# Altium project TimeDrive.PrjPcb (part 1 of 2)
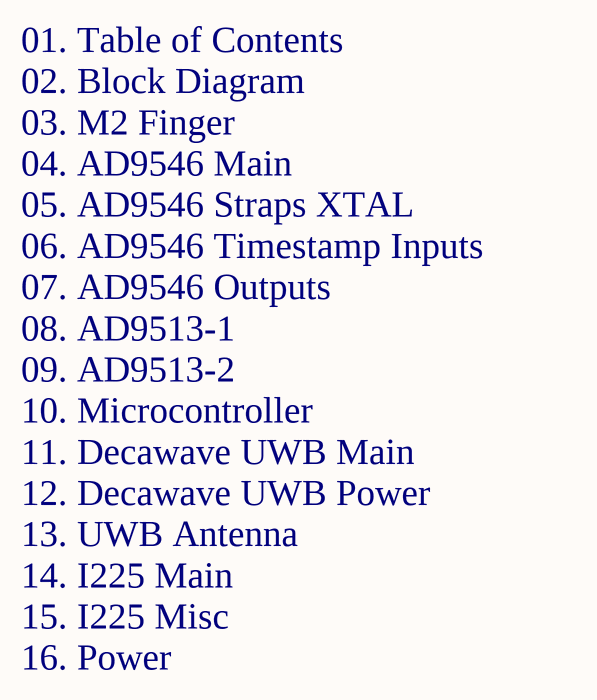
[diagram p0: 01-TableOfContents.SchDoc]
9 sheets, 225 parts. Net scope: global (net labels, ports and power ports of the same name join across sheets).
Board file: TimeDrive.PcbDoc
Sheets:
  01-TableOfContents.SchDoc
  03-M2Finger.SchDoc
  05-AD9546_StrapsXtal.SchDoc
  06-AD9546_TimestampInputs.SchDoc
  09-AD9513-2.SchDoc
  10-Microcontroller-1.SchDoc
  12-UWB-Power.SchDoc
  15-I225-MISC.SchDoc
  16-Power.SchDoc

## Sheet 01-TableOfContents.SchDoc
size A; SheetNumber: 1; SheetTotal: 1

### Notes on the sheet
- 01. Table of Contents
- 02. Block Diagram
- 03. M2 Finger
- 04. AD9546 Main
- 05. AD9546 Straps XTAL
- 06. AD9546 Timestamp Inputs
- 07. AD9546 Outputs
- 08. AD9513-1
- 09. AD9513-2
- 10. Microcontroller
- 11. Decawave UWB Main
- 12. Decawave UWB Power
- 13. UWB Antenna
- 14. I225 Main
- 15. I225 Misc
- 16. Power

## Sheet 03-M2Finger.SchDoc
size A; SheetNumber: 3; SheetTotal: 16
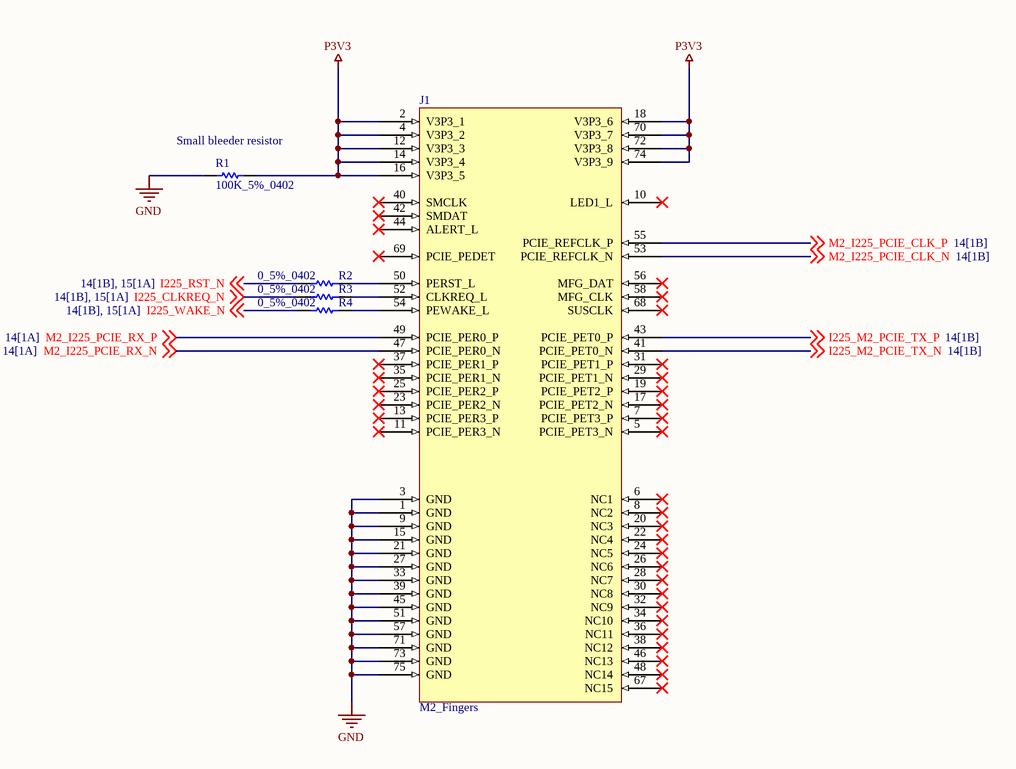
[diagram p1: 03-M2Finger.SchDoc]

### Parts
J1  M2_Fingers  [M.2 PCIe fingers]
R1  100K_5%_0402  [RESC1005X40X25LL05T05]
R2  0_5%_0402  [RESC1005X40X25LL10T10]
R3  0_5%_0402  [RESC1005X40X25LL10T10]
R4  0_5%_0402  [RESC1005X40X25LL10T10]

### Nets
GND: J1.1(GND) J1.3(GND) J1.9(GND) J1.15(GND) J1.21(GND) J1.27(GND) J1.33(GND) J1.39(GND) J1.45(GND) J1.51(GND) J1.57(GND) J1.71(GND) J1.73(GND) J1.75(GND) R1.1
P3V3: J1.2(V3P3_1) J1.4(V3P3_2) J1.12(V3P3_3) J1.14(V3P3_4) J1.16(V3P3_5) J1.18(V3P3_6) J1.70(V3P3_7) J1.72(V3P3_8) J1.74(V3P3_9) R1.2
I225_CLKREQ_N: R3.1 ; off-sheet I225_CLKREQ_N
I225_M2_PCIE_TX_N: J1.41(PCIE_PET0_N) ; off-sheet I225_M2_PCIE_TX_N
I225_M2_PCIE_TX_P: J1.43(PCIE_PET0_P) ; off-sheet I225_M2_PCIE_TX_P
I225_RST_N: R2.1 ; off-sheet I225_RST_N
I225_WAKE_N: R4.1 ; off-sheet I225_WAKE_N
M2_I225_PCIE_CLK_N: J1.53(PCIE_REFCLK_N) ; off-sheet M2_I225_PCIE_CLK_N
M2_I225_PCIE_CLK_P: J1.55(PCIE_REFCLK_P) ; off-sheet M2_I225_PCIE_CLK_P
M2_I225_PCIE_RX_N: J1.47(PCIE_PER0_N) ; off-sheet M2_I225_PCIE_RX_N
M2_I225_PCIE_RX_P: J1.49(PCIE_PER0_P) ; off-sheet M2_I225_PCIE_RX_P
NetJ1_50: J1.50(PERST_L) R2.2
NetJ1_52: J1.52(CLKREQ_L) R3.2
NetJ1_54: J1.54(PEWAKE_L) R4.2

Not connected (* = marked no-connect by the designer): J1 5(PCIE_PET3_N)* 6(NC1)* 7(PCIE_PET3_P)* 8(NC2)* 10(LED1_L)* 11(PCIE_PER3_N)* 13(PCIE_PER3_P)* 17(PCIE_PET2_N)* 19(PCIE_PET2_P)* 20(NC3)* 22(NC4)* 23(PCIE_PER2_N)* 24(NC5)* 25(PCIE_PER2_P)* 26(NC6)* 28(NC7)* 29(PCIE_PET1_N)* 30(NC8)* 31(PCIE_PET1_P)* 32(NC9)* 34(NC10)* 35(PCIE_PER1_N)* 36(NC11)* 37(PCIE_PER1_P)* 38(NC12)* 40(SMCLK)* 42(SMDAT)* 44(ALERT_L)* 46(NC13)* 48(NC14)* 56(MFG_DAT)* 58(MFG_CLK)* 67(NC15)* 68(SUSCLK)* 69(PCIE_PEDET)*

### Notes on the sheet
- (near R1) Small bleeder resistor

### Library data of the parts
R1 = CMP-2002-08125-1: Part Number: CRCW0402100KJNED; Manufacturer: Vishay Dale
R2-R4 = CMP-2002-04569-1: Manufacturer: KOA Speer; Part Number: RK73Z1ETTP

## Sheet 05-AD9546_StrapsXtal.SchDoc
size A; SheetNumber: 5; SheetTotal: 16
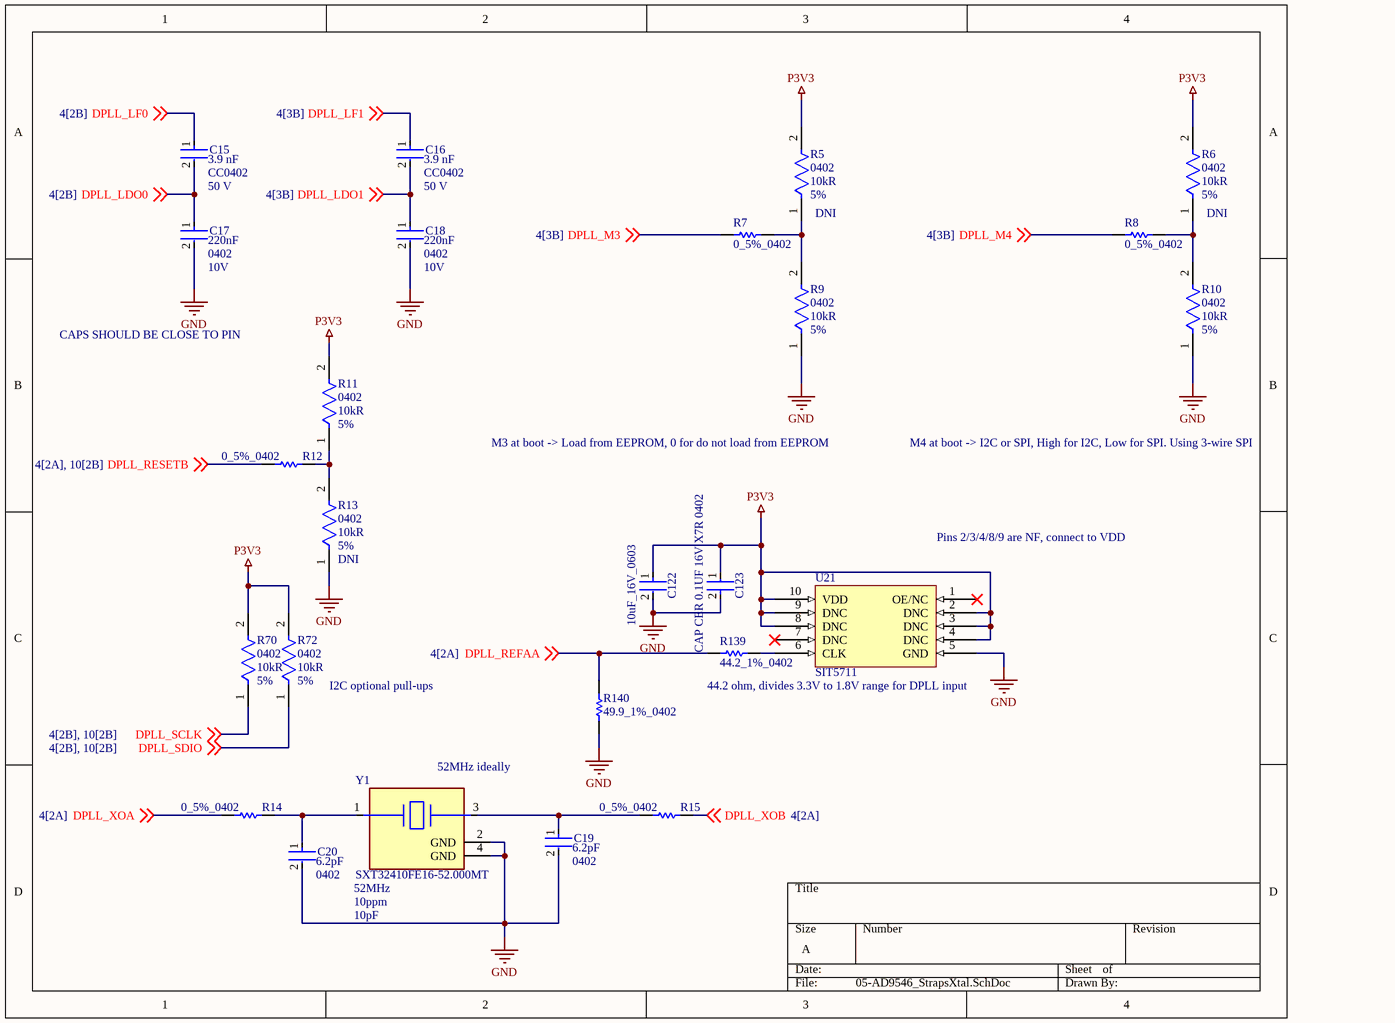
[diagram p2: 05-AD9546_StrapsXtal.SchDoc]

### Parts
C15  value 3.9 nF  Voltage Rating: 50 V  Package: CC0402  [FP-CC0402-MFG]  (hidden comment: CC0402KRX7R9BB392)
C16  value 3.9 nF  Voltage Rating: 50 V  Package: CC0402  [FP-CC0402-MFG]  (hidden comment: CC0402KRX7R9BB392)
C17  Voltage: 10V  Case/Package: 0402  Capacitance: 220nF  [FP-GRM155-0_05-IPC_A]  (hidden comment: GRM155R61A224KE19D)
C18  Voltage: 10V  Case/Package: 0402  Capacitance: 220nF  [FP-GRM155-0_05-IPC_A]  (hidden comment: GRM155R61A224KE19D)
C19  Case/Package: 0402  Capacitance: 6.2pF  [FP-CL468-IPC_C]  (hidden comment: CL05C6R2CB5NNNC)
C20  Case/Package: 0402  Capacitance: 6.2pF  [FP-CL468-IPC_C]  (hidden comment: CL05C6R2CB5NNNC)
C122  10uF_16V_0603  [FP-C1608-MFG]
C123  GRM155R71C104KA88D  [FP-GRM15-MFG]  (value not drawn)
R5  Case/Package: 0402  Resistance: 10kR  Tolerance: 5%  [FP-CRCW0402-e3-IPC_B]  (hidden comment: CRCW040210K0JNED)  (no BOM)
R6  Case/Package: 0402  Resistance: 10kR  Tolerance: 5%  [FP-CRCW0402-e3-IPC_B]  (hidden comment: CRCW040210K0JNED)  (no BOM)
R7  0_5%_0402  [RESC1005X40X25ML05T10]
R8  0_5%_0402  [RESC1005X40X25ML05T10]
R9  Case/Package: 0402  Resistance: 10kR  Tolerance: 5%  [FP-CRCW0402-e3-IPC_B]  (hidden comment: CRCW040210K0JNED)
R10  Case/Package: 0402  Resistance: 10kR  Tolerance: 5%  [FP-CRCW0402-e3-IPC_B]  (hidden comment: CRCW040210K0JNED)
R11  Case/Package: 0402  Resistance: 10kR  Tolerance: 5%  [FP-CRCW0402-e3-IPC_B]  (hidden comment: CRCW040210K0JNED)
R12  0_5%_0402  [RESC1005X40X25LL10T10]
R13  Case/Package: 0402  Resistance: 10kR  Tolerance: 5%  [FP-CRCW0402-e3-IPC_B]  (hidden comment: CRCW040210K0JNED)  (no BOM)
R14  0_5%_0402  [RESC1005X40X25LL10T10]
R15  0_5%_0402  [RESC1005X40X25LL10T10]
R70  Case/Package: 0402  Resistance: 10kR  Tolerance: 5%  [FP-CRCW0402-e3-IPC_B]  (hidden comment: CRCW040210K0JNED)
R72  Case/Package: 0402  Resistance: 10kR  Tolerance: 5%  [FP-CRCW0402-e3-IPC_B]  (hidden comment: CRCW040210K0JNED)
R139  44.2_1%_0402  [RESC0402(1005)_M]
R140  49.9_1%_0402  [RESC1005X40X25NL05T05]
U21  SIT5711  [SIT5711]
Y1  SXT32410FE16-52.000MT  Frequency: 52MHz  Frequency Stability: 10ppm  Load Capacitance: 10pF  [FP-402-MFG]

### Nets
GND: C17.2 C18.2 C19.2 C20.2 C122.2 C123.2 R9.1 R10.1 R13.1 R140.1 U21.5(GND) Y1.2(GND) Y1.4(GND)
P3V3: C122.1 C123.1 R5.2 R6.2 R11.2 R70.2 R72.2 U21.2(DNC) U21.3(DNC) U21.4(DNC) U21.8(DNC) U21.9(DNC) U21.10(VDD)
DPLL_LDO0: C15.2 C17.1 ; off-sheet DPLL_LDO0
DPLL_LDO1: C16.2 C18.1 ; off-sheet DPLL_LDO1
DPLL_LF0: C15.1 ; off-sheet DPLL_LF0
DPLL_LF1: C16.1 ; off-sheet DPLL_LF1
DPLL_M3: R7.1 ; off-sheet DPLL_M3
DPLL_M4: R8.1 ; off-sheet DPLL_M4
DPLL_REFAA: R139.1 R140.2 ; off-sheet DPLL_REFAA
DPLL_RESETB: R12.1 ; off-sheet DPLL_RESETB
DPLL_SCLK: R70.1 ; off-sheet DPLL_SCLK
DPLL_SDIO: R72.1 ; off-sheet DPLL_SDIO
DPLL_XOA: R14.1 ; off-sheet DPLL_XOA
DPLL_XOB: R15.2 ; off-sheet DPLL_XOB
NetC19_1: C19.1 R15.1 Y1.3
NetC20_1: C20.1 R14.2 Y1.1
NetR5_1: R5.1 R7.2 R9.2
NetR6_1: R6.1 R8.2 R10.2
NetR11_1: R11.1 R12.2 R13.2
NetR139_2: R139.2 U21.6(CLK)

Not connected (* = marked no-connect by the designer): U21 1(OE/NC)* 7(DNC)*

### Notes on the sheet
- CAPS SHOULD BE CLOSE TO PIN
- M3 at boot -> Load from EEPROM, 0 for do not load from EEPROM
- M4 at boot -> I2C or SPI, High for I2C, Low for SPI. Using 3-wire SPI
- Pins 2/3/4/8/9 are NF, connect to VDD
- (near R72) I2C optional pull-ups
- 44.2 ohm, divides 3.3V to 1.8V range for DPLL input
- (near Y1) 52MHz ideally

### Library data of the parts
C15 C16 = CMP-03422-000890-1: CAP CER 3900PF 50V X7R 0402; Manufacturer: YAGEO; Tolerance: 0.1; Temperature Coefficient: 30ppm/°C; Material: Ceramic; Automotive Grade: NA; Digikey Description: CAP CER 3900PF 50V X7R 0402; Octopart: https://octopart.com/cc0402krx7r9bb392-yageo-9291741; Category: Cap; Temperature Characteristic: X7R; Footprint Url: http://www.yageo.com/exep/pages/download/literatures/UPY-C_GEN_24.pdf; Height: 0.55mm; ComponentLink2Description: Datasheet; Capacitance: 3.9 nF; RoHS: TRUE; Device Class L1: Passive Components; ComponentLink2URL: http://www.yageo.com/documents/recent/UPY-GP_NP0_16V-to-50V_16.pdf; Temperature Range Low: -55°C; Automotive: No; Manufacturer Part Number: CC0402KRX7R9BB392; Temperature: -55°C to +125°C; Ipc Land Pattern Name: CAPC10050X50; Device Class L3: Ceramic Capacitors; Device Class L2: Capacitors; Mouser Description: Multilayer Ceramic Capacitors MLCC - SMD/SMT 3.9nF 50V X7R 10%; Lead Free: Yes; Temperature Range High: +125°C
C17 C18 = CMP-2008-04561-5: CAP CER 0.22UF 10V X5R 0402; Tolerance: 10%; Material: Ceramic; Insulation Resistance: 10GR; Package Quantity: 1; Termination: SMD/SMT; Max Operating Temperature: 85°C; REACH SVHC: No SVHC; Thickness: 0.022inch; Mount: Surface Mount; Height: 0.5mm; Length: 1mm; Lead Free: Lead Free; Number of Pins: 2; Case Code (Imperial): 0402; Min Operating Temperature: -55°C; Packaging: Tape and Reel; Dielectric: X5R; Depth: 0.5mm; Series: GRM; Case Code (Metric): 1005; Radiation Hardening: No; RoHS Compliant: Yes; Voltage Rating (DC): 10V; Voltage Rating: 10V; Dielectric Material: Ceramic; Width: 0.5mm
C19 C20 = CMP-13271-000420-1: Cap Ceramic 6.2pF 50V C0G ±0.25pF SMD 0402 +125°C Paper T/R; Radiation Hardening: No; Voltage Rating (DC): 50V; Thickness: 0.022inch; Height: 0.5mm; Case Code (Metric): 1005; Max Operating Temperature: 125°C; Case Code (Imperial): 0402; Voltage Rating: 50V; Min Operating Temperature: -55°C; Width: 0.02inch; Depth: 0.5mm; Length: 1mm; Dielectric: C0G; Packaging: Tape and Reel; Mount: Surface Mount
C122 = CMP-08246-000019-1: CAP CER 10UF 16V X5R 0603; Manufacturer: TDK Corporation; Manufacturer Part Number: C1608X5R1C106M080AB; Temperature Coefficient: 15%; Tolerance: 20%; Material: Ceramic; Octopart: https://octopart.com/c1608x5r1c106m080ab-tdk-26013480; ComponentLink2Description: Datasheet; Value: 10uF; Temperature Range Low: -55°C; Digikey Description: CAP CER 10UF 16V X5R 0603; Package: C1608; Lead Free: Yes; Mouser Description: Multilayer Ceramic Capacitors MLCC - SMD/SMT 0603 10uF 16volts X5R +/-20% GP; Device Class L2: Capacitors; Voltage Rating: 16V; RoHS: TRUE; Automotive: No; Height: 0.9mm; Ipc Land Pattern Name: CAPC16080X80; ComponentLink2URL: https://upverter.com/datasheet/6fbac97fd59b4a24a005814037d2a36a27db40e9.pdf; Temperature Range High: +85°C; Capacitance: 10uF; Temperature: -55°C to +85°C; Category: Cap; Device Class L1: Passive Components; Device Class L3: Ceramic Capacitors; Temperature Characteristic: X5R
C123 = CMP-2100-03641-2: CAP CER 0.1UF 16V X7R 0402; Manufacturer: Murata; Standoff Height: 0mm; Tolerance: 10%; Voltage Rating: 16Vdc; Material: Ceramic; Capacitance: 0.10μF; Value: 0.10μF; RoHS: TRUE; Manufacturer Part Number: GRM155R71C104KA88D; Temperature Characteristic: X7R; Octopart: https://octopart.com/grm155r71c104ka88d-murata-196880; Digikey Description: CAP CER 0.1UF 16V X7R 0402; Device Class L3: Ceramic Capacitors; Height: 0.55mm; ComponentLink2Description: Datasheet; Temperature Range Low: -55°C; Ipc Land Pattern Name: CAPC10050X219; ComponentLink2URL: https://search.murata.co.jp/Ceramy/image/img/A01X/G101/ENG/GRM155R71H471KA01-01A.pdf; Device Class L1: Passive Components; Lead Free: yes; Category: Cap; Package: GRM15; Temperature: -55°C to +125°C; Device Class L2: Capacitors; Temperature Range High: +125°C; Mouser Description: 0402 0.1 uF 16V ±10 % Tolerance X7R SMT Multilayer Ceramic Capacitor
R5 R6 R9-R11 R13 R70 R72 = CMP-2002-08136-3: RES Thick Film, 10kΩ, 5%, 0.063W, 200ppm/°C, 0402; Voltage Rating: 50V; Power Rating: 63mW; Military Standard: Not; Packaging: Tape and Reel; Case Code (Imperial): 0402; Min Operating Temperature: -55°C; Case Code (Metric): 1005; Temperature Coefficient: 200ppm/°C; Termination: SMD/SMT; Composition: Thick Film; Depth: 0.5mm; Number of Terminations: 2; Contact Plating: Tin; Height: 0.016inch; Width: 0.5mm; Max Operating Temperature: 155°C; Features: Automotive AEC-Q200; Length: 1mm; Radiation Hardening: No; Max Power Dissipation: 63mW; Mount: Surface Mount; Package Quantity: 1; Weight: 2.3E-05oz
  R5 R6 R13: DNI: DNI
R7 R8 = CMP-2002-03041-1: Part Number: CRCW04020000Z0EDHP; Manufacturer: Vishay Dale
R12 R14 R15 = CMP-2002-04569-1: as R2 on sheet 03-M2Finger
R139 = CMP-1011-00357-1: 44R2 0.063W 1% 0402 (1005 Metric)  SMD; Case-Metric: 1005; Value: 44.20 Ohm; Case-EIA: 0402; Tolerance: 1 %; Technology: SMT; Power: 0.063 W
R140 = CMP-2002-00969-1: Manufacturer: Panasonic; Part Number: ERJ-2RKF49R9X
Y1 = CMP-06858-000005-1: CRYSTAL 32.0000MHZ 10PF SMD; Series Resistance: 100R; Width: 0.063inch; Height: 0.022inch; Frequency Tolerance: 10ppm; Length: 0.079inch; Contact Plating: Gold; Package Quantity: 3000; Case/Package: SMD/SMT; ESR (Equivalent Series Resistance): 100R; Min Operating Temperature: -20°C; Tolerance: 10ppm; Packaging: Tape and Reel; Max Operating Temperature: 70°C; Mount: Surface Mount; Termination: SMD/SMT

## Sheet 06-AD9546_TimestampInputs.SchDoc
size A; SheetNumber: 6; SheetTotal: 16
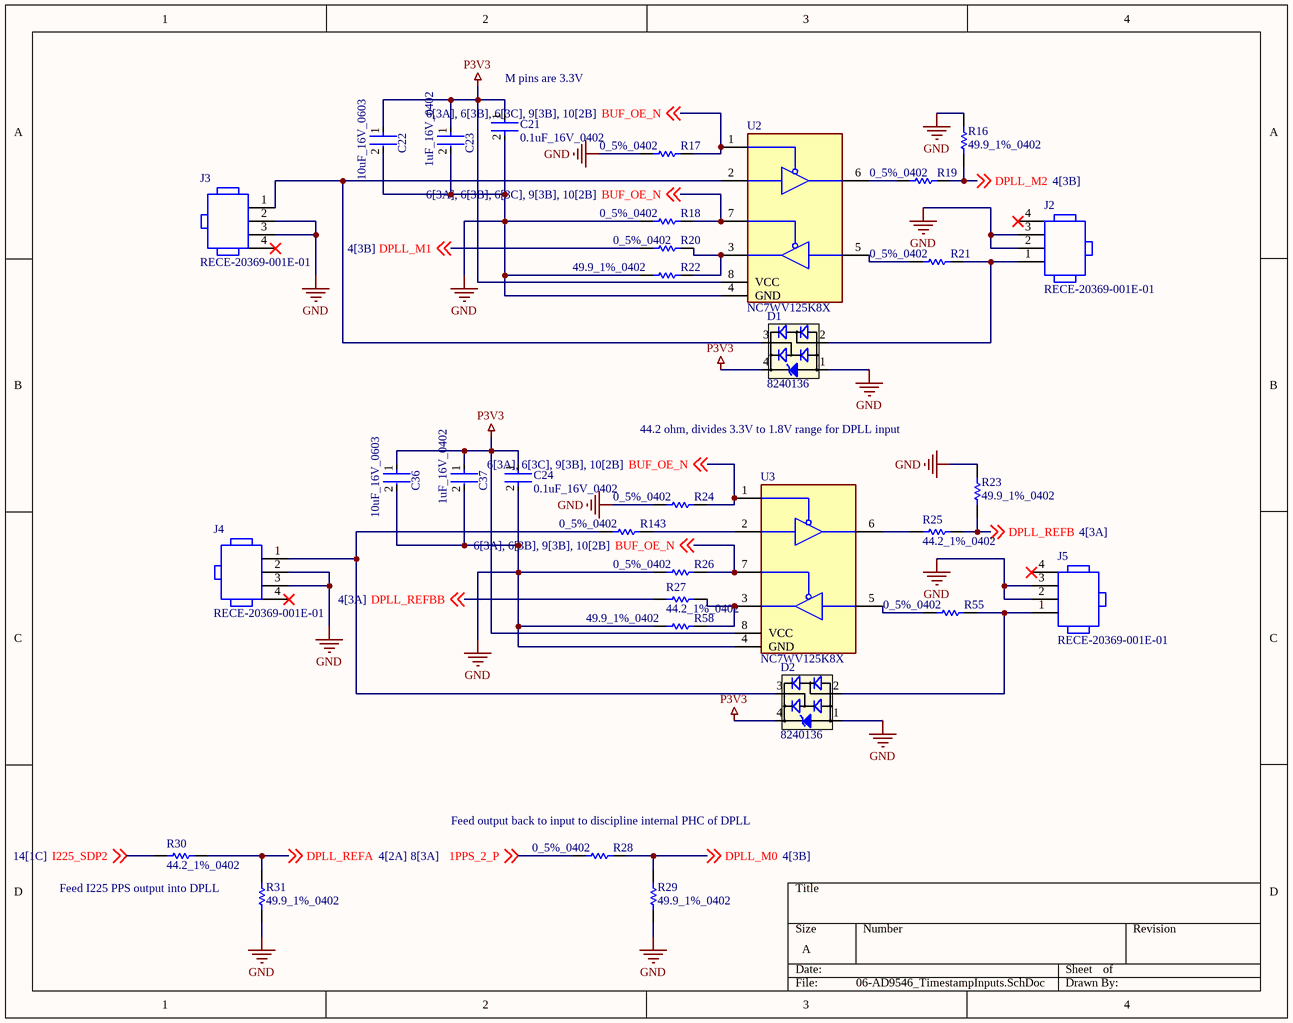
[diagram p3: 06-AD9546_TimestampInputs.SchDoc]

### Parts
C21  Digikey Description: 0.1uF_16V_0402  [FP-GRM15-MFG]  (hidden comment: GRM155R71C104KA88D)
C22  10uF_16V_0603  [FP-C1608-MFG]
C23  1uF_16V_0402  [FP-0402-L_1_0_0_05-W_0_5-IPC_C]
C24  Digikey Description: 0.1uF_16V_0402  [FP-GRM15-MFG]  (hidden comment: GRM155R71C104KA88D)
C36  10uF_16V_0603  [FP-C1608-MFG]
C37  1uF_16V_0402  [FP-0402-L_1_0_0_05-W_0_5-IPC_C]
D1  8240136  [SOT143-4L]
D2  8240136  [SOT143-4L]
J2  RECE-20369-001E-01  [TG-RECE-20369-001E-4_V]
J3  RECE-20369-001E-01  [TG-RECE-20369-001E-4_V]
J4  RECE-20369-001E-01  [TG-RECE-20369-001E-4_V]
J5  RECE-20369-001E-01  [TG-RECE-20369-001E-4_V]
R16  49.9_1%_0402  [RESC1005X40X25NL05T05]
R17  0_5%_0402  [RESC1005X40X25LL10T10]  (no BOM)
R18  0_5%_0402  [RESC1005X40X25LL10T10]
R19  0_5%_0402  [RESC1005X40X25LL10T10]
R20  0_5%_0402  [RESC1005X40X25LL10T10]
R21  0_5%_0402  [RESC1005X40X25LL10T10]
R22  49.9_1%_0402  [RESC1005X40X25NL05T05]
R23  49.9_1%_0402  [RESC1005X40X25NL05T05]
R24  0_5%_0402  [RESC1005X40X25LL10T10]
R25  44.2_1%_0402  [RESC1005X40X25LL05T05]
R26  0_5%_0402  [RESC1005X40X25LL10T10]
R27  44.2_1%_0402  [RESC1005X40X25LL05T05]
R28  0_5%_0402  [RESC1005X40X25LL10T10]
R29  49.9_1%_0402  [RESC1005X40X25NL05T05]
R30  44.2_1%_0402  [RESC1005X40X25LL05T05]
R31  49.9_1%_0402  [RESC1005X40X25NL05T05]
R55  0_5%_0402  [RESC1005X40X25LL10T10]
R58  49.9_1%_0402  [RESC1005X40X25NL05T05]
R143  0_5%_0402  [RESC1005X40X25LL10T10]
U2  NC7WV125K8X  [NC7WV125]
U3  NC7WV125K8X  [NC7WV125]

### Nets
GND: C21.2 C22.2 C23.2 C24.2 C36.2 C37.2 D1.1(GND) D2.1(GND) J2.2 J2.3 J3.2 J3.3 J4.2 J4.3 J5.2 J5.3 R16.2 R17.1 R18.1 R22.2 R23.2 R24.1 R26.1 R29.1 R31.1 R58.2 U2.4(GND) U3.4(GND)
P3V3: C21.1 C22.1 C23.1 C24.1 C36.1 C37.1 D1.4(VDD) D2.4(VDD) U2.8(VCC) U3.8(VCC)
1PPS_2_P: R28.1 ; off-sheet 1PPS_2_P
BUF_OE_N: R17.2 R18.2 R24.2 R26.2 U2.1 U2.7 U3.1 U3.7 ; off-sheet BUF_OE_N
DPLL_M0: R28.2 R29.2 ; off-sheet DPLL_M0
DPLL_M1: R20.1 ; off-sheet DPLL_M1
DPLL_M2: R16.1 R19.2 ; off-sheet DPLL_M2
DPLL_REFA: R30.2 R31.2 ; off-sheet DPLL_REFA
DPLL_REFB: R23.1 R25.2 ; off-sheet DPLL_REFB
DPLL_REFBB: R27.1 ; off-sheet DPLL_REFBB
I225_SDP2: R30.1 ; off-sheet I225_SDP2
NetD1_2: D1.2(I/O1) J2.1 R21.2
NetD1_3: D1.3(I/O2) J3.1 U2.2
NetD2_2: D2.2(I/O1) J5.1 R55.2
NetD2_3: D2.3(I/O2) J4.1 R143.1
NetR19_1: R19.1 U2.6
NetR20_2: R20.2 R22.1 U2.3
NetR21_1: R21.1 U2.5
NetR25_1: R25.1 U3.6
NetR27_2: R27.2 R58.1 U3.3
NetR55_1: R55.1 U3.5
NetR143_2: R143.2 U3.2

Not connected (* = marked no-connect by the designer): J2 4*; J3 4*; J4 4*; J5 4*

### Notes on the sheet
- (near C21) M pins are 3.3V
- 44.2 ohm, divides 3.3V to 1.8V range for DPLL input
- (near R28) Feed output back to input to discipline internal PHC of DPLL
- Feed I225 PPS output into DPLL

### Library data of the parts
C21 C24 = CMP-2100-03641-2: as C123 on sheet 05-AD9546_StrapsXtal; RoHS: TRUE; Manufacturer Part Number: GRM155R71C104KA88D; Temperature Characteristic: X7R; Octopart: https://octopart.com/grm155r71c104ka88d-murata-196880; Device Class L3: Ceramic Capacitors; Height: 0.55mm; ComponentLink2Description: Datasheet; Temperature Range Low: -55°C; Ipc Land Pattern Name: CAPC10050X219; ComponentLink2URL: https://search.murata.co.jp/Ceramy/image/img/A01X/G101/ENG/GRM155R71H471KA01-01A.pdf; Device Class L1: Passive Components; Lead Free: yes; Category: Cap; Package: GRM15; Temperature: -55°C to +125°C; Device Class L2: Capacitors; Temperature Range High: +125°C; Mouser Description: 0402 0.1 uF 16V ±10 % Tolerance X7R SMT Multilayer Ceramic Capacitor
C22 C36 = CMP-08246-000019-1: as C122 on sheet 05-AD9546_StrapsXtal; Octopart: https://octopart.com/c1608x5r1c106m080ab-tdk-26013480; ComponentLink2Description: Datasheet; Value: 10uF; Temperature Range Low: -55°C; Digikey Description: CAP CER 10UF 16V X5R 0603; Package: C1608; Lead Free: Yes; Mouser Description: Multilayer Ceramic Capacitors MLCC - SMD/SMT 0603 10uF 16volts X5R +/-20% GP; Device Class L2: Capacitors; Voltage Rating: 16V; RoHS: TRUE; Automotive: No; Height: 0.9mm; Ipc Land Pattern Name: CAPC16080X80; ComponentLink2URL: https://upverter.com/datasheet/6fbac97fd59b4a24a005814037d2a36a27db40e9.pdf; Temperature Range High: +85°C; Capacitance: 10uF; Temperature: -55°C to +85°C; Category: Cap; Device Class L1: Passive Components; Device Class L3: Ceramic Capacitors; Temperature Characteristic: X5R
C23 C37 = CMP-14477-003537-2: None; Tolerance: 20%; Voltage Rating (DC): 16V; Capacitance: 1uF; Dielectric: X5R; Height: 0.5mm; Package Quantity: 10000; Series: M; Max Operating Temperature: 85°C; Width: 0.02inch; Mount: Surface Mount; Thickness: 0.022inch; Length: 1mm; Min Operating Temperature: -55°C; Depth: 0.5mm; RoHS Compliant: Yes; Construction: Flat; Case/Package: 0402; Radiation Hardening: No; Packaging: Tape and Reel; Voltage: 16V; Voltage Rating: 16V; Halogen Free: Halogen Free
D1 D2 = CMP-1486-00002-1: TVS Diode WE-TVS-HS, VRWM=3.3V; Manufacturer: Wuerth Elektronik; Reverse Stand Off Voltage: 3.3V; PartNumber: 8240136; ComponentLink1Description: Manufacturer URL; PackageReference: SOT143-4L; ComponentLink1URL: http://www.we-online.com; ComponentLink2Description: Datasheet; ComponentLink2URL: http://katalog.we-online.de/kataloge/eisos/media/pdf/8240136.pdf
J2-J5 = CMP-0275-00001-2: RF Connector, Onboard Receptacle, IPEX MHFIII; Manufacturer: Taoglas; Packing: Tape and Reel; Mounting Technology: Surface Mount; PackageReference: RECE-20369-001E-01-4; ComponentLink1URL: http://www.taoglas.com/; Housing Color: Gold; DatasheetVersion: Rev. C; ComponentLink2URL: http://www.taoglas.com/images/product_images/original_images/RECE.20369.001E.01.pdf; ComponentLink3Description: Package Specification; PackageVersion: Rev. C; ComponentLink1Description: Manufacturer URL; ComponentLink2Description: Datasheet; PackageDescription: 4-Pin, Hand Drawn, Body 1.7x1.7mm; ComponentLink3URL: http://www.taoglas.com/images/product_images/original_images/RECE.20369.001E.01.pdf; PartNumber: RECE-20369-001E-01
R16 R22 R23 R29 R31 R58 = CMP-2002-00969-1: as R140 on sheet 05-AD9546_StrapsXtal
R17-R21 R24 R26 R28 R55 R143 = CMP-2002-04569-1: as R2 on sheet 03-M2Finger
R25 R27 R30 = CMP-2002-00011-1: Manufacturer: Vishay Dale; Part Number: CRCW040244R2FKED
U2 U3 = NC7WV125K8X: Integrated Circuit; Manufacturer_Name: ON Semiconductor; Datasheet Link: https://www.mouser.com/datasheet/2/308/NC7WV125-1301459.pdf; Height: 0.9mm; Manufacturer_Part_Number: NC7WV125K8X; Mouser Part Number: 512-NC7WV125K8X; Mouser Price/Stock: https://www.mouser.com/Search/Refine.aspx?Keyword=512-NC7WV125K8X; Arrow Part Number: NC7WV125K8X; Arrow Price/Stock: https://www.arrow.com/en/products/nc7wv125k8x/on-semiconductor

## Sheet 09-AD9513-2.SchDoc
size A; SheetNumber: 9; SheetTotal: 16
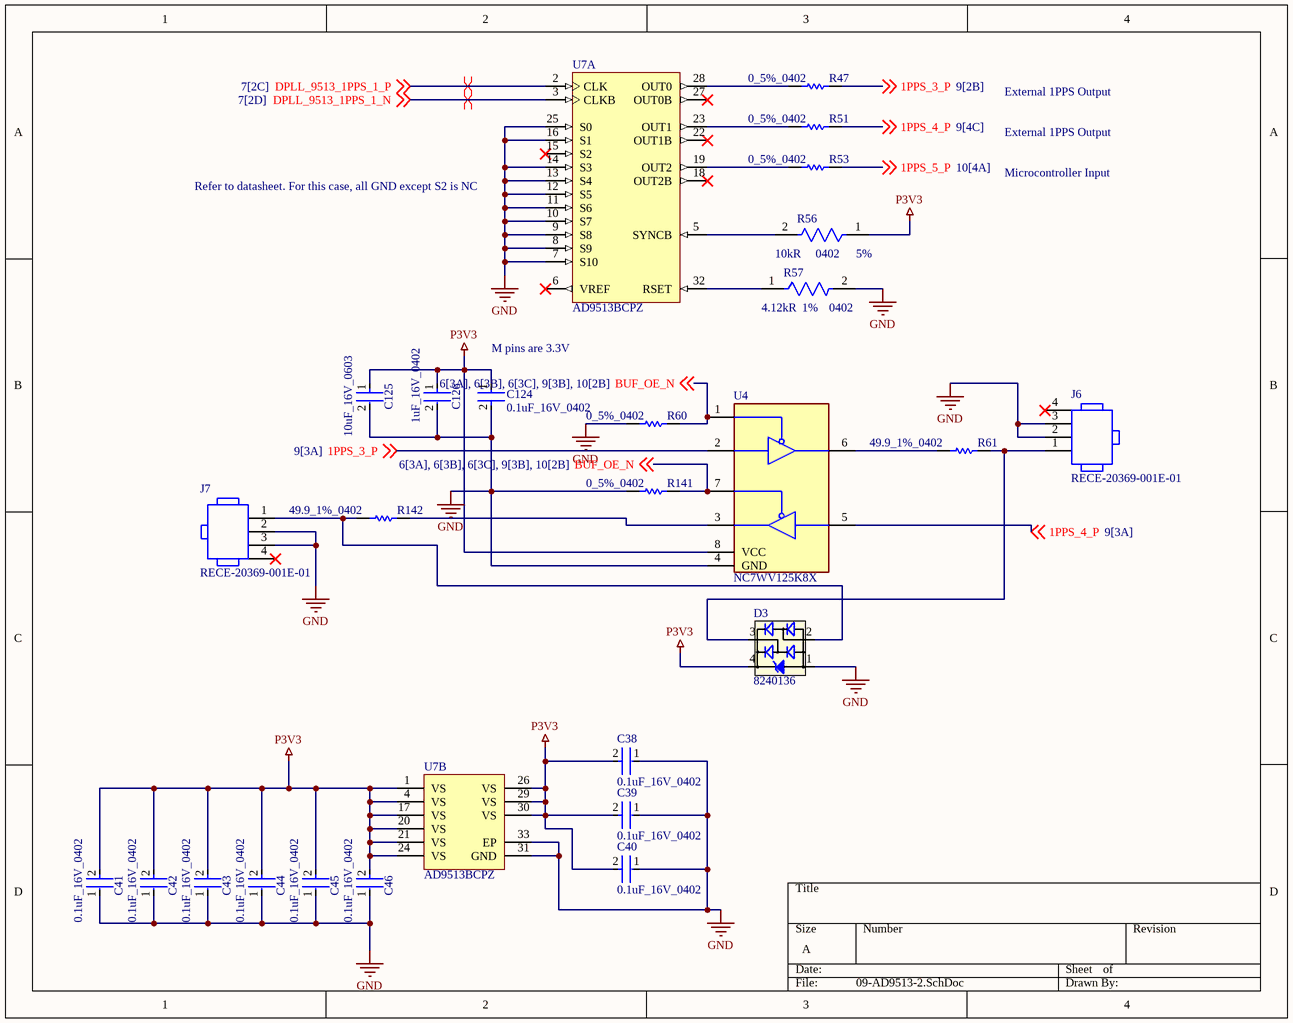
[diagram p4: 09-AD9513-2.SchDoc]

### Parts
C38  0.1uF_16V_0402  [FP-GRM15-MFG]
C39  0.1uF_16V_0402  [FP-GRM15-MFG]
C40  0.1uF_16V_0402  [FP-GRM15-MFG]
C41  0.1uF_16V_0402  [FP-GRM15-MFG]
C42  0.1uF_16V_0402  [FP-GRM15-MFG]
C43  0.1uF_16V_0402  [FP-GRM15-MFG]
C44  0.1uF_16V_0402  [FP-GRM15-MFG]
C45  0.1uF_16V_0402  [FP-GRM15-MFG]
C46  0.1uF_16V_0402  [FP-GRM15-MFG]
C124  Digikey Description: 0.1uF_16V_0402  [FP-GRM15-MFG]  (hidden comment: GRM155R71C104KA88D)
C125  10uF_16V_0603  [FP-C1608-MFG]
C126  1uF_16V_0402  [FP-0402-L_1_0_0_05-W_0_5-IPC_C]
D3  8240136  [SOT143-4L]
J6  RECE-20369-001E-01  [TG-RECE-20369-001E-4_V]
J7  RECE-20369-001E-01  [TG-RECE-20369-001E-4_V]
R47  0_5%_0402  [RESC1005X40X25LL10T10]
R51  0_5%_0402  [RESC1005X40X25LL10T10]
R53  0_5%_0402  [RESC1005X40X25LL10T10]
R56  Case/Package: 0402  Resistance: 10kR  Tolerance: 5%  [FP-CRCW0402-e3-IPC_B]  (hidden comment: CRCW040210K0JNED)
R57  Resistance: 4.12kR  Case/Package: 0402  Tolerance: 1%  [FP-CRCW0402-e3-IPC_A]  (hidden comment: CRCW04024K12FKED)
R60  0_5%_0402  [RESC1005X40X25LL10T10]
R61  49.9_1%_0402  [RESC1005X40X25NL05T05]
R141  0_5%_0402  [RESC1005X40X25LL10T10]
R142  49.9_1%_0402  [RESC1005X40X25NL05T05]
U4  NC7WV125K8X  [NC7WV125]
U7  AD9513BCPZ  [ADI-CP-32-2_N]  (parts A,B of 2)

### Nets
GND: C38.1 C39.1 C40.1 C41.1 C42.1 C43.1 C44.1 C45.1 C46.1 C124.2 C125.2 C126.2 D3.1(GND) J6.2 J6.3 J7.2 J7.3 R57.2 R60.1 R141.1 U4.4(GND) U7.7(S10) U7.8(S9) U7.9(S8) U7.10(S7) U7.11(S6) U7.12(S5) U7.13(S4) U7.14(S3) U7.16(S1) U7.25(S0) U7.31(GND) U7.33(EP)
P3V3: C38.2 C39.2 C40.2 C41.2 C42.2 C43.2 C44.2 C45.2 C46.2 C124.1 C125.1 C126.1 D3.4(VDD) R56.1 U4.8(VCC) U7.1(VS) U7.4(VS) U7.17(VS) U7.20(VS) U7.21(VS) U7.24(VS) U7.26(VS) U7.29(VS) U7.30(VS)
1PPS_3_P: R47.2 U4.2 ; off-sheet 1PPS_3_P
1PPS_4_P: R51.2 U4.5 ; off-sheet 1PPS_4_P
1PPS_5_P: R53.2 ; off-sheet 1PPS_5_P
BUF_OE_N: R60.2 R141.2 U4.1 U4.7 ; off-sheet BUF_OE_N
DPLL_9513_1PPS_1_N: U7.3(CLKB) ; off-sheet DPLL_9513_1PPS_1_N
DPLL_9513_1PPS_1_P: U7.2(CLK) ; off-sheet DPLL_9513_1PPS_1_P
NetD3_2: D3.2(I/O1) J7.1 R142.2
NetD3_3: D3.3(I/O2) J6.1 R61.1
NetR47_1: R47.1 U7.28(OUT0)
NetR51_1: R51.1 U7.23(OUT1)
NetR53_1: R53.1 U7.19(OUT2)
NetR56_2: R56.2 U7.5(SYNCB)
NetR57_1: R57.1 U7.32(RSET)
NetR61_2: R61.2 U4.6
NetR142_1: R142.1 U4.3

Not connected (* = marked no-connect by the designer): J6 4*; J7 4*; U7 6(VREF)* 15(S2)* 18(OUT2B)* 22(OUT1B)* 27(OUT0B)*

### Layout directives
differential pair; differential pair class 100ohm: DPLL_9513_1PPS_1_N, DPLL_9513_1PPS_1_P

### Notes on the sheet
- External 1PPS Output
- (near U7) Refer to datasheet. For this case, all GND except S2 is NC
- Microcontroller Input
- M pins are 3.3V

### Library data of the parts
C38-C46 = CMP-2100-03641-2: CAP CER 0.1UF 16V X7R 0402; Manufacturer Part Number: GRM155R71C104KA88D; Manufacturer: Murata; Standoff Height: 0mm; Tolerance: 10%; Voltage Rating: 16Vdc; Material: Ceramic; Capacitance: 0.10μF; Value: 0.10μF; RoHS: TRUE; Temperature Characteristic: X7R; Octopart: https://octopart.com/grm155r71c104ka88d-murata-196880; Digikey Description: CAP CER 0.1UF 16V X7R 0402; Device Class L3: Ceramic Capacitors; Height: 0.55mm; ComponentLink2Description: Datasheet; Temperature Range Low: -55°C; Ipc Land Pattern Name: CAPC10050X219; ComponentLink2URL: https://search.murata.co.jp/Ceramy/image/img/A01X/G101/ENG/GRM155R71H471KA01-01A.pdf; Device Class L1: Passive Components; Lead Free: yes; Category: Cap; Package: GRM15; Temperature: -55°C to +125°C; Device Class L2: Capacitors; Temperature Range High: +125°C; Mouser Description: 0402 0.1 uF 16V ±10 % Tolerance X7R SMT Multilayer Ceramic Capacitor
C124 = CMP-2100-03641-2: as C123 on sheet 05-AD9546_StrapsXtal; RoHS: TRUE; Manufacturer Part Number: GRM155R71C104KA88D; Temperature Characteristic: X7R; Octopart: https://octopart.com/grm155r71c104ka88d-murata-196880; Device Class L3: Ceramic Capacitors; Height: 0.55mm; ComponentLink2Description: Datasheet; Temperature Range Low: -55°C; Ipc Land Pattern Name: CAPC10050X219; ComponentLink2URL: https://search.murata.co.jp/Ceramy/image/img/A01X/G101/ENG/GRM155R71H471KA01-01A.pdf; Device Class L1: Passive Components; Lead Free: yes; Category: Cap; Package: GRM15; Temperature: -55°C to +125°C; Device Class L2: Capacitors; Temperature Range High: +125°C; Mouser Description: 0402 0.1 uF 16V ±10 % Tolerance X7R SMT Multilayer Ceramic Capacitor
C125 = CMP-08246-000019-1: as C122 on sheet 05-AD9546_StrapsXtal; Octopart: https://octopart.com/c1608x5r1c106m080ab-tdk-26013480; ComponentLink2Description: Datasheet; Value: 10uF; Temperature Range Low: -55°C; Digikey Description: CAP CER 10UF 16V X5R 0603; Package: C1608; Lead Free: Yes; Mouser Description: Multilayer Ceramic Capacitors MLCC - SMD/SMT 0603 10uF 16volts X5R +/-20% GP; Device Class L2: Capacitors; Voltage Rating: 16V; RoHS: TRUE; Automotive: No; Height: 0.9mm; Ipc Land Pattern Name: CAPC16080X80; ComponentLink2URL: https://upverter.com/datasheet/6fbac97fd59b4a24a005814037d2a36a27db40e9.pdf; Temperature Range High: +85°C; Capacitance: 10uF; Temperature: -55°C to +85°C; Category: Cap; Device Class L1: Passive Components; Device Class L3: Ceramic Capacitors; Temperature Characteristic: X5R
C126 = CMP-14477-003537-2: as C23 on sheet 06-AD9546_TimestampInputs; Height: 0.5mm; Package Quantity: 10000; Series: M; Max Operating Temperature: 85°C; Width: 0.02inch; Mount: Surface Mount; Thickness: 0.022inch; Length: 1mm; Min Operating Temperature: -55°C; Depth: 0.5mm; RoHS Compliant: Yes; Construction: Flat; Case/Package: 0402; Radiation Hardening: No; Packaging: Tape and Reel; Voltage: 16V; Voltage Rating: 16V; Halogen Free: Halogen Free
D3 = CMP-1486-00002-1: as D1 on sheet 06-AD9546_TimestampInputs; PartNumber: 8240136; ComponentLink1Description: Manufacturer URL; PackageReference: SOT143-4L; ComponentLink1URL: http://www.we-online.com; ComponentLink2Description: Datasheet; ComponentLink2URL: http://katalog.we-online.de/kataloge/eisos/media/pdf/8240136.pdf
J6 J7 = CMP-0275-00001-2: as J2 on sheet 06-AD9546_TimestampInputs; Mounting Technology: Surface Mount; PackageReference: RECE-20369-001E-01-4; ComponentLink1URL: http://www.taoglas.com/; Housing Color: Gold; DatasheetVersion: Rev. C; ComponentLink2URL: http://www.taoglas.com/images/product_images/original_images/RECE.20369.001E.01.pdf; ComponentLink3Description: Package Specification; PackageVersion: Rev. C; ComponentLink1Description: Manufacturer URL; ComponentLink2Description: Datasheet; PackageDescription: 4-Pin, Hand Drawn, Body 1.7x1.7mm; ComponentLink3URL: http://www.taoglas.com/images/product_images/original_images/RECE.20369.001E.01.pdf; PartNumber: RECE-20369-001E-01
R47 R51 R53 R60 R141 = CMP-2002-04569-1: as R2 on sheet 03-M2Finger
R56 = CMP-2002-08136-3: as R5 on sheet 05-AD9546_StrapsXtal; Military Standard: Not; Packaging: Tape and Reel; Case Code (Imperial): 0402; Min Operating Temperature: -55°C; Case Code (Metric): 1005; Temperature Coefficient: 200ppm/°C; Termination: SMD/SMT; Composition: Thick Film; Depth: 0.5mm; Number of Terminations: 2; Contact Plating: Tin; Height: 0.016inch; Width: 0.5mm; Max Operating Temperature: 155°C; Features: Automotive AEC-Q200; Length: 1mm; Radiation Hardening: No; Max Power Dissipation: 63mW; Mount: Surface Mount; Package Quantity: 1; Weight: 2.3E-05oz
R57 = CMP-1011-00579-3: RES Thick Film, 4.12kΩ, 1%, 0.063W, 100ppm/°C, 0402; Power Rating: 63mW; Voltage Rating: 50V; Temperature Coefficient: 100ppm/°C; Max Operating Temperature: 155°C; Number of Terminations: 2; Number of Pins: 2; Radiation Hardening: No; Features: Automotive AEC-Q200; Height: 0.35mm; Length: 1mm; Lead Free: Lead Free; Military Standard: Not; Composition: Thick Film; Weight: 2.3E-05oz; Case Code (Metric): 1005; Case Code (Imperial): 0402; Max Power Dissipation: 63mW; Contact Plating: Tin; Min Operating Temperature: -55°C; Width: 0.02inch; Packaging: Tape and Reel; Depth: 0.5mm; Termination: SMD/SMT; Voltage Rating (DC): 50V; Package Quantity: 10
R61 R142 = CMP-2002-00969-1: as R140 on sheet 05-AD9546_StrapsXtal
U4 = NC7WV125K8X: as U2 on sheet 06-AD9546_TimestampInputs; Datasheet Link: https://www.mouser.com/datasheet/2/308/NC7WV125-1301459.pdf; Height: 0.9mm; Manufacturer_Part_Number: NC7WV125K8X; Mouser Part Number: 512-NC7WV125K8X; Mouser Price/Stock: https://www.mouser.com/Search/Refine.aspx?Keyword=512-NC7WV125K8X; Arrow Part Number: NC7WV125K8X; Arrow Price/Stock: https://www.arrow.com/en/products/nc7wv125k8x/on-semiconductor
U7 = CMP-0288-00055-2: 3 Outputs, 800 MHz Clock Distribution IC with Dividers and Delay Adjust, 3.3 V Supply, Industrial, 32-pin QFN (CP-32-2), Tray; Manufacturer: Analog Devices; # of Outputs: 3; Max f-out: 800 MHz; On-Chip VCO or DCO: No; I/O Interface: Pin Select; Supply Voltage (V): 3.3; Output Logic: CMOS, LVDS; # of Inputs: 1; Packing: Tray; DatasheetVersion: Rev. 0; ComponentLink5Description: Reference Circuit; PartNumber: AD9513BCPZ; ComponentLink1Description: Manufacturer URL; ComponentLink2Description: Datasheet; ComponentLink1URL: http://www.analog.com/en/index.html; ComponentLink4URL: http://www.analog.com/en/clock-and-timing/clock-generation-and-distribution/ad9513/products/product.html; Code_JEDEC: MO-220-VHHD-2; ComponentLink3URL: http://www.analog.com/static/imported-files/packages/414143737956480539664569CP_32_2.pdf; PackageDescription: 32-Pin Lead Frame Chip Scale Package, Body 5 x 5 mm, Pitch 0.5 mm; PackageReference: CP-32-2; ComponentLink3Description: Package Specification; ComponentLink4Description: Product URL; Mounting Technology: Surface Mount; PackageVersion: 01/2005; ComponentLink2URL: http://www.analog.com/static/imported-files/data_sheets/AD9513.pdf; ComponentLink5URL: http://www.analog.com/en/clock-and-timing/clock-generation-and-distribution/ad9513/products/product.html#product-recommendations

## Sheet 10-Microcontroller-1.SchDoc
size A; SheetNumber: 10; SheetTotal: 16
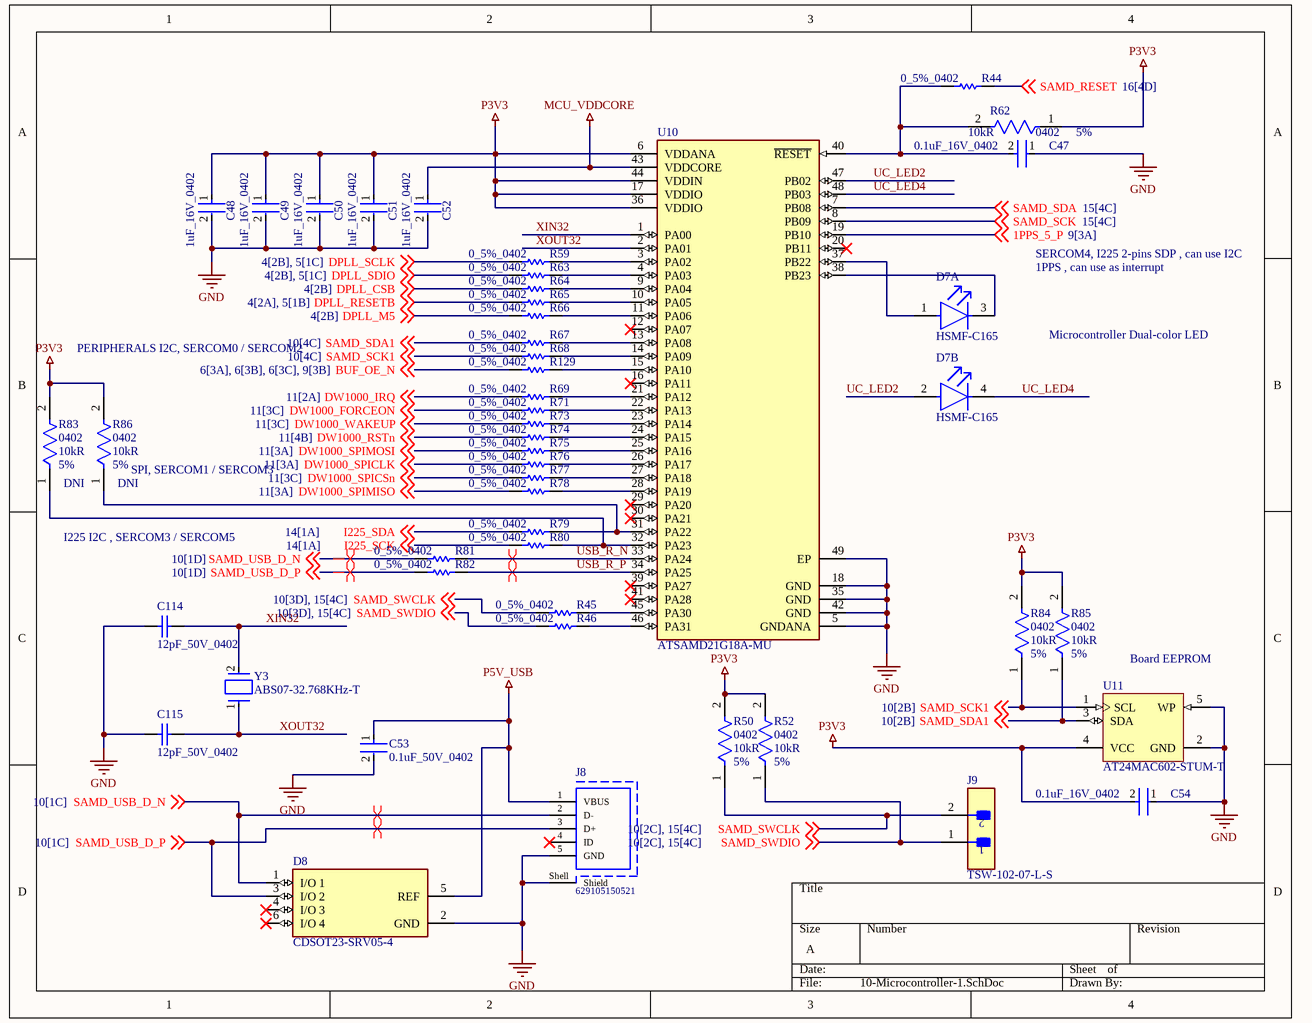
[diagram p5: 10-Microcontroller-1.SchDoc]

### Parts
C47  0.1uF_16V_0402  [FP-GRM15-MFG]
C48  1uF_16V_0402  [FP-0402-L_1_0_0_05-W_0_5-IPC_A]
C49  1uF_16V_0402  [FP-0402-L_1_0_0_05-W_0_5-IPC_A]
C50  1uF_16V_0402  [FP-0402-L_1_0_0_05-W_0_5-IPC_A]
C51  1uF_16V_0402  [FP-0402-L_1_0_0_05-W_0_5-IPC_A]
C52  1uF_16V_0402  [FP-0402-L_1_0_0_05-W_0_5-IPC_A]
C53  0.1uF_50V_0402  [FP-C1005-050-0_05-IPC_C]
C54  0.1uF_16V_0402  [FP-GRM15-MFG]
C114  12pF_50V_0402  [CAPC1005X55X25LL05T05]
C115  12pF_50V_0402  [CAPC1005X55X25LL05T05]
D7  HSMF-C165  [FP-HSMF-C165-MFG]  (parts A,B of 2)
D8  CDSOT23-SRV05-4  [FP-CDSOT23-SRV05-4-MFG]
J8  629105150521  [629105150521]
J9  TSW-102-07-L-S  [FP-TSW-102-07-L-S-MFG]
R44  0_5%_0402  [RESC1005X40X25LL10T10]
R45  0_5%_0402  [RESC1005X40X25LL10T10]
R46  0_5%_0402  [RESC1005X40X25LL10T10]
R50  Case/Package: 0402  Resistance: 10kR  Tolerance: 5%  [FP-CRCW0402-e3-IPC_B]  (hidden comment: CRCW040210K0JNED)
R52  Case/Package: 0402  Resistance: 10kR  Tolerance: 5%  [FP-CRCW0402-e3-IPC_B]  (hidden comment: CRCW040210K0JNED)
R59  0_5%_0402  [RESC1005X40X25LL10T10]
R62  Case/Package: 0402  Resistance: 10kR  Tolerance: 5%  [FP-CRCW0402-e3-IPC_B]  (hidden comment: CRCW040210K0JNED)
R63  0_5%_0402  [RESC1005X40X25LL10T10]
R64  0_5%_0402  [RESC1005X40X25LL10T10]
R65  0_5%_0402  [RESC1005X40X25LL10T10]
R66  0_5%_0402  [RESC1005X40X25LL10T10]
R67  0_5%_0402  [RESC1005X40X25LL10T10]
R68  0_5%_0402  [RESC1005X40X25LL10T10]
R69  0_5%_0402  [RESC1005X40X25LL10T10]
R71  0_5%_0402  [RESC1005X40X25LL10T10]
R73  0_5%_0402  [RESC1005X40X25LL10T10]
R74  0_5%_0402  [RESC1005X40X25LL10T10]
R75  0_5%_0402  [RESC1005X40X25LL10T10]
R76  0_5%_0402  [RESC1005X40X25LL10T10]
R77  0_5%_0402  [RESC1005X40X25LL10T10]
R78  0_5%_0402  [RESC1005X40X25LL10T10]
R79  0_5%_0402  [RESC1005X40X25LL10T10]
R80  0_5%_0402  [RESC1005X40X25LL10T10]
R81  0_5%_0402  [RESC1005X40X25LL10T10]
R82  0_5%_0402  [RESC1005X40X25LL10T10]
R83  Case/Package: 0402  Resistance: 10kR  Tolerance: 5%  [FP-CRCW0402-e3-IPC_B]  (hidden comment: CRCW040210K0JNED)  (no BOM)
R84  Case/Package: 0402  Resistance: 10kR  Tolerance: 5%  [FP-CRCW0402-e3-IPC_B]  (hidden comment: CRCW040210K0JNED)
R85  Case/Package: 0402  Resistance: 10kR  Tolerance: 5%  [FP-CRCW0402-e3-IPC_B]  (hidden comment: CRCW040210K0JNED)
R86  Case/Package: 0402  Resistance: 10kR  Tolerance: 5%  [FP-CRCW0402-e3-IPC_B]  (hidden comment: CRCW040210K0JNED)  (no BOM)
R129  0_5%_0402  [RESC1005X40X25LL10T10]
U10  ATSAMD21G18A-MU  [FP-C04-21493-MFG]
U11  AT24MAC602-STUM-T  [ATML-5TS1_M]
Y3  ABS07-32.768KHz-T  [FP-ABS07-MFG]

### Nets
GND: C47.1 C48.2 C49.2 C50.2 C51.2 C52.2 C53.2 C54.1 C114.2 C115.2 D8.2(GND) J8.5(GND) J8.Shell(Shield) U10.5(GNDANA) U10.18(GND) U10.35(GND) U10.42(GND) U10.49(EP) U11.2(GND) U11.5(WP)
MCU_VDDCORE: C52.1 U10.43(VDDCORE)
P3V3: C48.1 C49.1 C50.1 C51.1 C54.2 R50.2 R52.2 R62.1 R83.2 R84.2 R85.2 R86.2 U10.6(VDDANA) U10.17(VDDIO) U10.36(VDDIO) U10.44(VDDIN) U11.4(VCC)
P5V_USB: C53.1 D8.5(REF) J8.1(VBUS)
1PPS_5_P: U10.19(PB10) ; off-sheet 1PPS_5_P
BUF_OE_N: R129.1 ; off-sheet BUF_OE_N
DPLL_CSB: R64.1 ; off-sheet DPLL_CSB
DPLL_M5: R66.1 ; off-sheet DPLL_M5
DPLL_RESETB: R65.1 ; off-sheet DPLL_RESETB
DPLL_SCLK: R59.1 ; off-sheet DPLL_SCLK
DPLL_SDIO: R63.1 ; off-sheet DPLL_SDIO
DW1000_FORCEON: R71.1 ; off-sheet DW1000_FORCEON
DW1000_IRQ: R69.1 ; off-sheet DW1000_IRQ
DW1000_RSTn: R74.1 ; off-sheet DW1000_RSTn
DW1000_SPICLK: R76.1 ; off-sheet DW1000_SPICLK
DW1000_SPICSn: R77.1 ; off-sheet DW1000_SPICSn
DW1000_SPIMISO: R78.1 ; off-sheet DW1000_SPIMISO
DW1000_SPIMOSI: R75.1 ; off-sheet DW1000_SPIMOSI
DW1000_WAKEUP: R73.1 ; off-sheet DW1000_WAKEUP
I225_SCK: R80.1 ; off-sheet I225_SCK
I225_SDA: R79.1 ; off-sheet I225_SDA
SAMD_RESET: R44.2 ; off-sheet SAMD_RESET
SAMD_SCK: U10.8(PB09) ; off-sheet SAMD_SCK
SAMD_SCK1: R68.1 R84.1 U11.1(SCL) ; off-sheet SAMD_SCK1
SAMD_SDA: U10.7(PB08) ; off-sheet SAMD_SDA
SAMD_SDA1: R67.1 R85.1 U11.3(SDA) ; off-sheet SAMD_SDA1
SAMD_SWCLK: J9.2 R45.1 R50.1 ; off-sheet SAMD_SWCLK
SAMD_SWDIO: J9.1 R46.1 R52.1 ; off-sheet SAMD_SWDIO
SAMD_USB_D_N: D8.1(I/O_1) J8.2(D-) R81.1 ; off-sheet SAMD_USB_D_N
SAMD_USB_D_P: D8.3(I/O_2) J8.3(D+) R82.1 ; off-sheet SAMD_USB_D_P
UC_LED2: D7.2(RED_A) U10.47(PB02)
UC_LED4: D7.4(RED_C) U10.48(PB03)
USB_R_N: R81.2 U10.33(PA24)
USB_R_P: R82.2 U10.34(PA25)
XIN32: C114.1 U10.1(PA00) Y3.2
XOUT32: C115.1 U10.2(PA01) Y3.1
NetC47_2: C47.2 R44.1 R62.2 U10.40(~{RESET})
NetD7_1: D7.1(GREEN_A) U10.37(PB22)
NetD7_3: D7.3(GREEN_C) U10.38(PB23)
NetR45_2: R45.2 U10.45(PA30)
NetR46_2: R46.2 U10.46(PA31)
NetR59_2: R59.2 U10.3(PA02)
NetR63_2: R63.2 U10.4(PA03)
NetR64_2: R64.2 U10.9(PA04)
NetR65_2: R65.2 U10.10(PA05)
NetR66_2: R66.2 U10.11(PA06)
NetR67_2: R67.2 U10.13(PA08)
NetR68_2: R68.2 U10.14(PA09)
NetR69_2: R69.2 U10.21(PA12)
NetR71_2: R71.2 U10.22(PA13)
NetR73_2: R73.2 U10.23(PA14)
NetR74_2: R74.2 U10.24(PA15)
NetR75_2: R75.2 U10.25(PA16)
NetR76_2: R76.2 U10.26(PA17)
NetR77_2: R77.2 U10.27(PA18)
NetR78_2: R78.2 U10.28(PA19)
NetR79_2: R79.2 R86.1 U10.31(PA22)
NetR80_2: R80.2 R83.1 U10.32(PA23)
NetR129_2: R129.2 U10.15(PA10)

Not connected (* = marked no-connect by the designer): D8 4(I/O_3)* 6(I/O_4)*; J8 4(ID)*; U10 12(PA07)* 16(PA11)* 20(PB11)* 29(PA20)* 30(PA21)* 39(PA27)* 41(PA28)*

### Layout directives
differential pair; differential pair class 100ohm: SAMD_USB_D_N, SAMD_USB_D_P
differential pair; differential pair class 90ohm: SAMD_USB_D_N, SAMD_USB_D_P, USB_R_N, USB_R_P

### Notes on the sheet
- SERCOM4, I225 2-pins SDP , can use I2C
- 1PPS , can use as interrupt
- PERIPHERALS I2C, SERCOM0 / SERCOM2
- Microcontroller Dual-color LED
- (near R86) SPI, SERCOM1 / SERCOM3
- I225 I2C , SERCOM3 / SERCOM5
- (near U11) Board EEPROM

### Library data of the parts
C47 C54 = CMP-2100-03641-2: as C38 on sheet 09-AD9513-2; RoHS: TRUE; Temperature Characteristic: X7R; Octopart: https://octopart.com/grm155r71c104ka88d-murata-196880; Digikey Description: CAP CER 0.1UF 16V X7R 0402; Device Class L3: Ceramic Capacitors; Height: 0.55mm; ComponentLink2Description: Datasheet; Temperature Range Low: -55°C; Ipc Land Pattern Name: CAPC10050X219; ComponentLink2URL: https://search.murata.co.jp/Ceramy/image/img/A01X/G101/ENG/GRM155R71H471KA01-01A.pdf; Device Class L1: Passive Components; Lead Free: yes; Category: Cap; Package: GRM15; Temperature: -55°C to +125°C; Device Class L2: Capacitors; Temperature Range High: +125°C; Mouser Description: 0402 0.1 uF 16V ±10 % Tolerance X7R SMT Multilayer Ceramic Capacitor
C48-C52 = CMP-14477-000104-2: None; Tolerance: 10%; Voltage Rating: 16V; Dielectric: X5R; Capacitance: 1uF; Packaging: Tape and Reel; Depth: 0.5mm; Mount: Surface Mount; Thickness: 0.022inch; Package Quantity: 1; Min Operating Temperature: -55°C; Series: M; Voltage Rating (DC): 16V; Termination: SMD/SMT; Case/Package: 0402; Number of Pins: 2; Case Code (Imperial): 0402; Length: 1mm; Halogen Free: Halogen Free; Case Code (Metric): 1005; Width: 0.02inch; RoHS Compliant: Yes; Radiation Hardening: No; Max Operating Temperature: 85°C; Height: 0.5mm; Construction: Flat
C53 = CMP-2000-05393-2: Multilayer Ceramic Capacitors 100nF ±10% 50V X7R SMD 0402; Voltage: 50V; Dielectric Material: Ceramic; Min Operating Temperature: -55°C; Depth: 0.5mm; Radiation Hardening: No; RoHS Compliant: Yes; Voltage Rating (DC): 50V; Lead Free: Lead Free; Resistor Type: Ceramic; Height: 0.5mm; Dielectric: X7R; Thickness: 0.022inch; Case/Package: 0402; Case Code (Metric): 1005; Termination: SMD/SMT; Capacitance: 100nF; Packaging: Tape and Reel; Max Operating Temperature: 125°C; Mount: Surface Mount; Package Quantity: 1; Width: 0.02inch; Weight: 2.3E-05oz; Voltage Rating: 50V; Tolerance: 10%; Construction: Flat; Case Code (Imperial): 0402; Length: 1mm; REACH SVHC: No SVHC; Series: C
C114 C115 = CMP-2000-06069-1: Chip Capacitor, 12 pF, +/- 5%, 50 V, -55 to 125 degC, 0402 (1005 Metric), RoHS, Tape and Reel; Manufacturer: Yageo; Capacitance: 12pF; Voltage - Rated: 50V; Other Names: 311-1016-6311-1266-6311-1266-6-ND; Catalog Drawings: CC_0402; Featured Product: CommodityMultilayerCeramicCapacitors–CCSeries; Product Training Modules: MultilayerCeramicCapacitors; Online Catalog: CCSeries; Temperature Coefficient: C0G,NP0; Mounting Technology: SurfaceMount; Package Reference: 0402; Lead Style: -; Datasheet URL: http://www.yageo.com/NewPortal/yageodocoutput?fileName=/pdf/MLCC/UPY-GP_NP0_16V-to-50V_14.pdf; Height - Seated (Max): -; Mounting Type: SurfaceMount,MLCC; Series: CC; Standard Package: 1; Manufacturer URL: http://www.yageo.com/; Package / Case: 0402(1005Metric); Features: -; Applications: GeneralPurpose; Family: CeramicCapacitors; Size / Dimension: 0.039"Lx0.020"W(1.00mmx0.50mm); Ratings: -; Package Description: 2-Pin Surface Mount Device, Body 1 x 0.5 mm; Datasheet Version: Rev. 14, 07/2016; Lead Spacing: -; Packaging: Digi-Reel®; Category: Capacitors; Tolerance: ±5%; Thickness (Max): 0.022"(0.55mm); Operating Temperature: -55°C~125°C
D7 = CMP-2000-06424-2: LED GREEN/RED DIFFUSED 0603 SMD; Reverse Voltage: 5V; Dominant Wavelength: 621nm; Number of Elements: 2; Shape: Rectangular; Luminous Intensity: 10mcd; Forward Current: 20mA; Lens Color: White; Illumination Color: Green; Power Dissipation: 52mW; Wavelength: 572nm; Viewing Angle: 120°; Forward Voltage: 2.2V; Max Operating Temperature: 85°C; Lens Transparency: Diffused; Width: 0.8mm; Case/Package: 0603; Packaging: Tape and Reel; Case Code (Metric): 1608; Depth: 0.8mm; REACH SVHC: No SVHC; Number of LEDs: 2; Radiation Hardening: No; Lens Style: Rectangular; Color: Green; Case Code (Imperial): 0603; Min Operating Temperature: -40°C; Power Rating: 52mW; Number of Pins: 4; Number of Terminals: 4; Package Quantity: 1; Mount: Surface Mount; Height: 0.5mm; Length: 1.6mm; Lead Free: Lead Free; Test Current: 20mA
D8 = CMP-07401-000007-1: TVS DIODE 5V 15V SOT23-6; Manufacturer: Bourns Inc.; Standoff Height: 0.2mm; Direction: Bidirectional; Peak Pulse Power: 500W; Max Junction Temp: +150°C; Number Of Channels: 4; Breakdown Voltage: 6V; Peak Pulse Current: 30A; Temperature Range High: +150°C; RoHS: TRUE; Category: Diode; Clamping Voltage: 15V; Reverse Standoff Voltage: 5V; Manufacturer Part Number: CDSOT23-SRV05-4; Octopart: https://octopart.com/cdsot23-srv05-4-bourns-1679449; Automotive: No; ComponentLink2URL: https://www.bourns.com/docs/Product-Datasheets/CDSOT23-SRV05-4.pdf; Device Class L1: Circuit Protection; Temperature: -55°C to +150°C; Device Class L2: TVS Diodes; Temperature Range Low: -55°C; Lead Free: Yes; Device Class L3: unset; Height: 1.45mm; Package: CDSOT23-SRV05-4; Ipc Land Pattern Name: SOT95P280X118-6; Mouser Description: CDSOT23-SRV05-4, Quad Uni-Directional TVS Diode, 500W, 6-Pin SOT-23; ComponentLink2Description: Datasheet; Digikey Description: TVS DIODE 5V 15V SOT23-6
J8 = CMP-1502-03252-1: Micro USB 2.0 Type B Receptacle WR-COM, Horizontal, SMT, with Pegs, High Current at Pin 1 & Pin 5; Manufacturer: Wurth Elektronik; Contact Resistance: 30mOhm; Rated Current: 3A; Working Voltage: 30VAC; Package Reference: 629105150521; Mounting Technology: SMT; Connector Type: MicroUSB2.0TypeB; Operating Temperature: -40to85degC; Orientation: Horizontal; Manufacturer URL: http://www.we-online.de; Datasheet URL: https://katalog.we-online.de/em/datasheet/629105150521.pdf; Part Number: 629105150521; Packaging: TapeandReel; Gender: Receptacle; Publisher: WurthElektronik
J9 = CMP-02766-001428-1: CONN HEADER VERT 2POS 2.54MM; Voltage Rating: 550V; Current Rating: 7.6A; Gender: Male; Number of Contacts: 2; Connector Type: Male Pin; Radiation Hardening: No; Orientation: Straight; Contact Plating: Gold; Max Operating Temperature: 125°C; Mount: Through Hole; Package Quantity: 1; Number of Rows: 1; Housing Material: Polyester; RoHS Compliant: Yes; Length: 5.08mm; Max Voltage Rating (AC): 550V; Pitch: 2.54mm; Packaging: Bulk; Depth: 2.54mm; Termination: Solder; Min Operating Temperature: -55°C; Housing Color: Black; Lead Free: Lead Free; Color: Black; Number of Positions: 2; Width: 2.54mm; Max Current Rating: 7.6A; REACH SVHC: No SVHC; Contact Material: Bronze; Contact Mating Length: 0.23inch; Series: TSW; Contact Type: Male Pin
R44-R46 R59 R63-R69 R71 R73-R82 R129 = CMP-2002-04569-1: as R2 on sheet 03-M2Finger
R50 R52 R62 R83-R86 = CMP-2002-08136-3: as R5 on sheet 05-AD9546_StrapsXtal; Military Standard: Not; Packaging: Tape and Reel; Case Code (Imperial): 0402; Min Operating Temperature: -55°C; Case Code (Metric): 1005; Temperature Coefficient: 200ppm/°C; Termination: SMD/SMT; Composition: Thick Film; Depth: 0.5mm; Number of Terminations: 2; Contact Plating: Tin; Height: 0.016inch; Width: 0.5mm; Max Operating Temperature: 155°C; Features: Automotive AEC-Q200; Length: 1mm; Radiation Hardening: No; Max Power Dissipation: 63mW; Mount: Surface Mount; Package Quantity: 1; Weight: 2.3E-05oz
  R83 R86: DNI: DNI
U10 = CMP-06276-000052-1: IC MCU 32BIT 256KB FLASH 48QFN; Interface: I2C; Oscillator Type: Internal; Core Architecture: ARM; Peripherals: Brown-out Detect/Reset; Number of I/Os: 38; Frequency: 48MHz; Max Operating Temperature: 85°C; Memory Size: 256KB; Memory Type: FLASH; Case/Package: QFN; Packaging: Tray; Min Operating Temperature: -40°C
U11 = CMP-2100-03583-1: 2-Kbit (256 x 8), 2-wire Serial EEPROM with a Factory-Programmed EUI-64(TM)Address Plus an Embedded Unique 128-bit Serial Number, 1.7 to 5.5 V, -40 to 85 degC, 5-Pin SOT23 (5TS1), Tape and Reel; Manufacturer: Atmel; Min Supply Voltage: 1.7V; Nominal Supply Current: 3mA; Max Frequency: 1MHz; Max Supply Voltage: 5.5V; Number of Pins: 5; RoHSCompliant: true; Mount: SurfaceMount; Datasheet URL: http://www.atmel.com/Images/Atmel-8807-SEEPROM-AT24MAC402-602-Datasheet.pdf; Frequency: 1MHz; Min Operating Temperature: -40degC; Package Reference: 5TS1; Radiation Hardening: No; Package Description: 5-Pin Plastic Thin Shrink Small Outline Package, Body 2.9 x 1.6 mm, Pitch 0.95 mm; Package Quantity: 5000; Packaging: TapeandReel; Max Operating Temperature: 85degC; Case/Package: SOT-23; Manufacturer URL: http://www.atmel.com/; Datasheet Version: Rev. 8808E, 01/2015
Y3 = CMP-0447-00001-3: CRYSTAL 32.7680KHZ 12.5PF SMD; Frequency Tolerance: 20ppm; Series Resistance: 70kR; Operating Frequency: 32.768 kHz; Number of Pins: 2; Package Quantity: 3000; Tolerance: 20ppm; Max Operating Temperature: 85°C; Width: 0.061inch; Frequency: 32.768kHz; Termination: SMD/SMT; Min Operating Temperature: -40°C; Radiation Hardening: No; Series: ABS07; Length: 3.2mm; Case/Package: CSMD; ESR (Equivalent Series Resistance): 70kR; RoHS Compliant: Yes; Load Capacitance: 12.5pF; Depth: 1.5mm; REACH SVHC: No SVHC; Height: 0.035inch; Packaging: Tape and Reel; Lead Free: Lead Free